# EAGLE design Conductor_S000A (EAGLE 7.4.0)
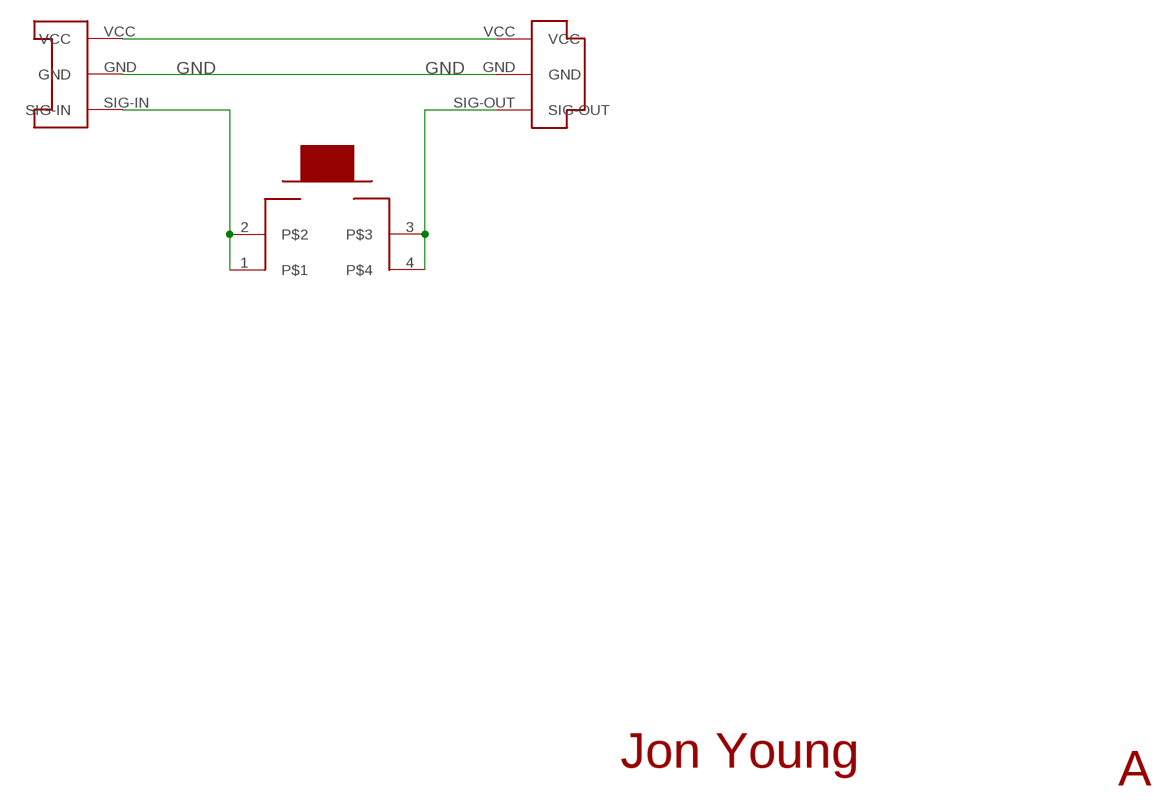
[diagram p0: schematic, sheet 1]

## Parts
U$1  CONN-PLUG-3POS-3MM  [PLUG-3POS-3MM-SMD]
U$2  CONN-SOCKET-3POS-3MM  [SOCKET-3POS-3MM-SMD]
U$3  PUSH_BUTTON  [ESWITCH-TL3300CF260Q]

## Nets
GND: U$1.GND U$2.GND
N$5: U$2.SIG-IN U$3.1 U$3.2
N$6: U$1.SIG-OUT U$3.3 U$3.4
VCC: U$1.VCC U$2.VCC

## Notes on the sheet
- Jon Young
- A

## Library data of the parts
U$1 = EmbeddedPlayground:CONN-PLUG-3POS-3MM: Surface mount board to board connector. Female socket, 3 position.
U$2 = EmbeddedPlayground:CONN-SOCKET-3POS-3MM: Surface mount board to board connector. Female socket, 3 position.
U$3 = EmbeddedPlayground:PUSH_BUTTON

## Board
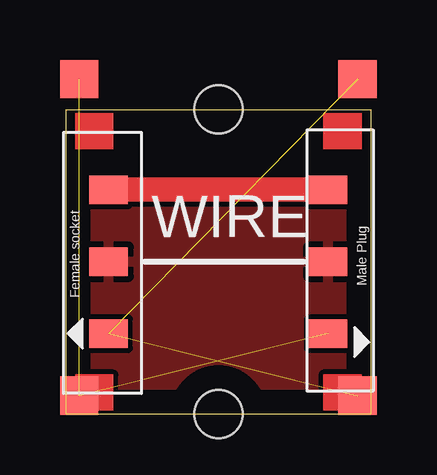
[diagram p1: board, top side]
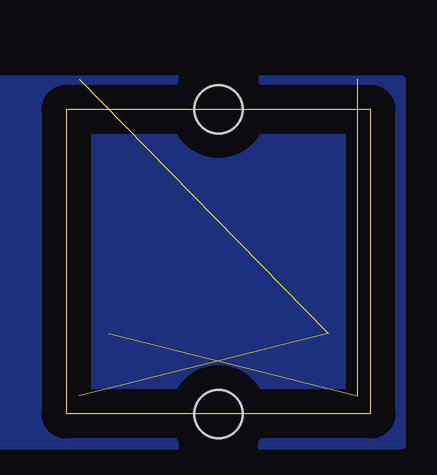
[diagram p2: board, bottom side, seen from below]

Size 12.7 x 12.7 mm. Coordinates in mm from the lower left corner, seen from the top.
Outline: 0,0 12.7,0 12.7,12.7 0,12.7 0,0
Copper layers (1*16): Top 0.035mm / dielectric 1.5mm / Bottom 0.035mm
Design rules "default": minimum track width 10mil, minimum drill 24mil, track to track 8mil, track to pad 8mil, pad to pad 8mil, via to via 8mil, smd to smd 8mil, copper to edge 40mil, drill to drill 8mil, minimum pad ring 10mil, minimum via ring 8mil, stop-mask expansion 4mil, vias tented up to drill 0mil, thermal gap 10mil
Holes 2 mm at 6.35,0 6.35,12.7

### Footprints (pad centres in the part's own frame; a part is rotated, then mirrored left to right if it is on the bottom)
PLUG-3POS-3MM-SMD = smd 1.2 x 1.6: GND 0,0; SIG-OUT 3,0; VCC -3,0
SOCKET-3POS-3MM-SMD = smd 1.2 x 1.6: GND 0,0; SIG-IN -3,0; VCC 3,0
ESWITCH-TL3300CF260Q = smd 1.6 x 1.6: 1 -6.6,5.8; 2 6.6,5.8; 3 -6.6,-5.8; 4 6.6,-5.8

### Placement (x,y rotation side)
U$1  10.92,6.35 270 top
U$2  1.78,6.35 90 top
U$3  6.35,7.37 270 top

### Tracks (layer width: path | path; a pad name or v marks a point on that pad's centre or on a via)
GND
  pour Top: -1.27,13.91 -1.27,-1.27 16.42,-1.27 16.42,13.91
  pour Bottom: -1.27,13.91 16.42,13.91 16.42,-1.27 -1.27,-1.27
N$5  (2 unrouted)
N$6  (2 unrouted)
VCC
  Top 0.254: U$1.VCC 6.41,9.35
  Top 1.016: U$2.VCC U$1.VCC

### Text on the board
tPlace: WIRE